# EasyEDA schematic 原理图_RecycleBin-4工控板V8.json
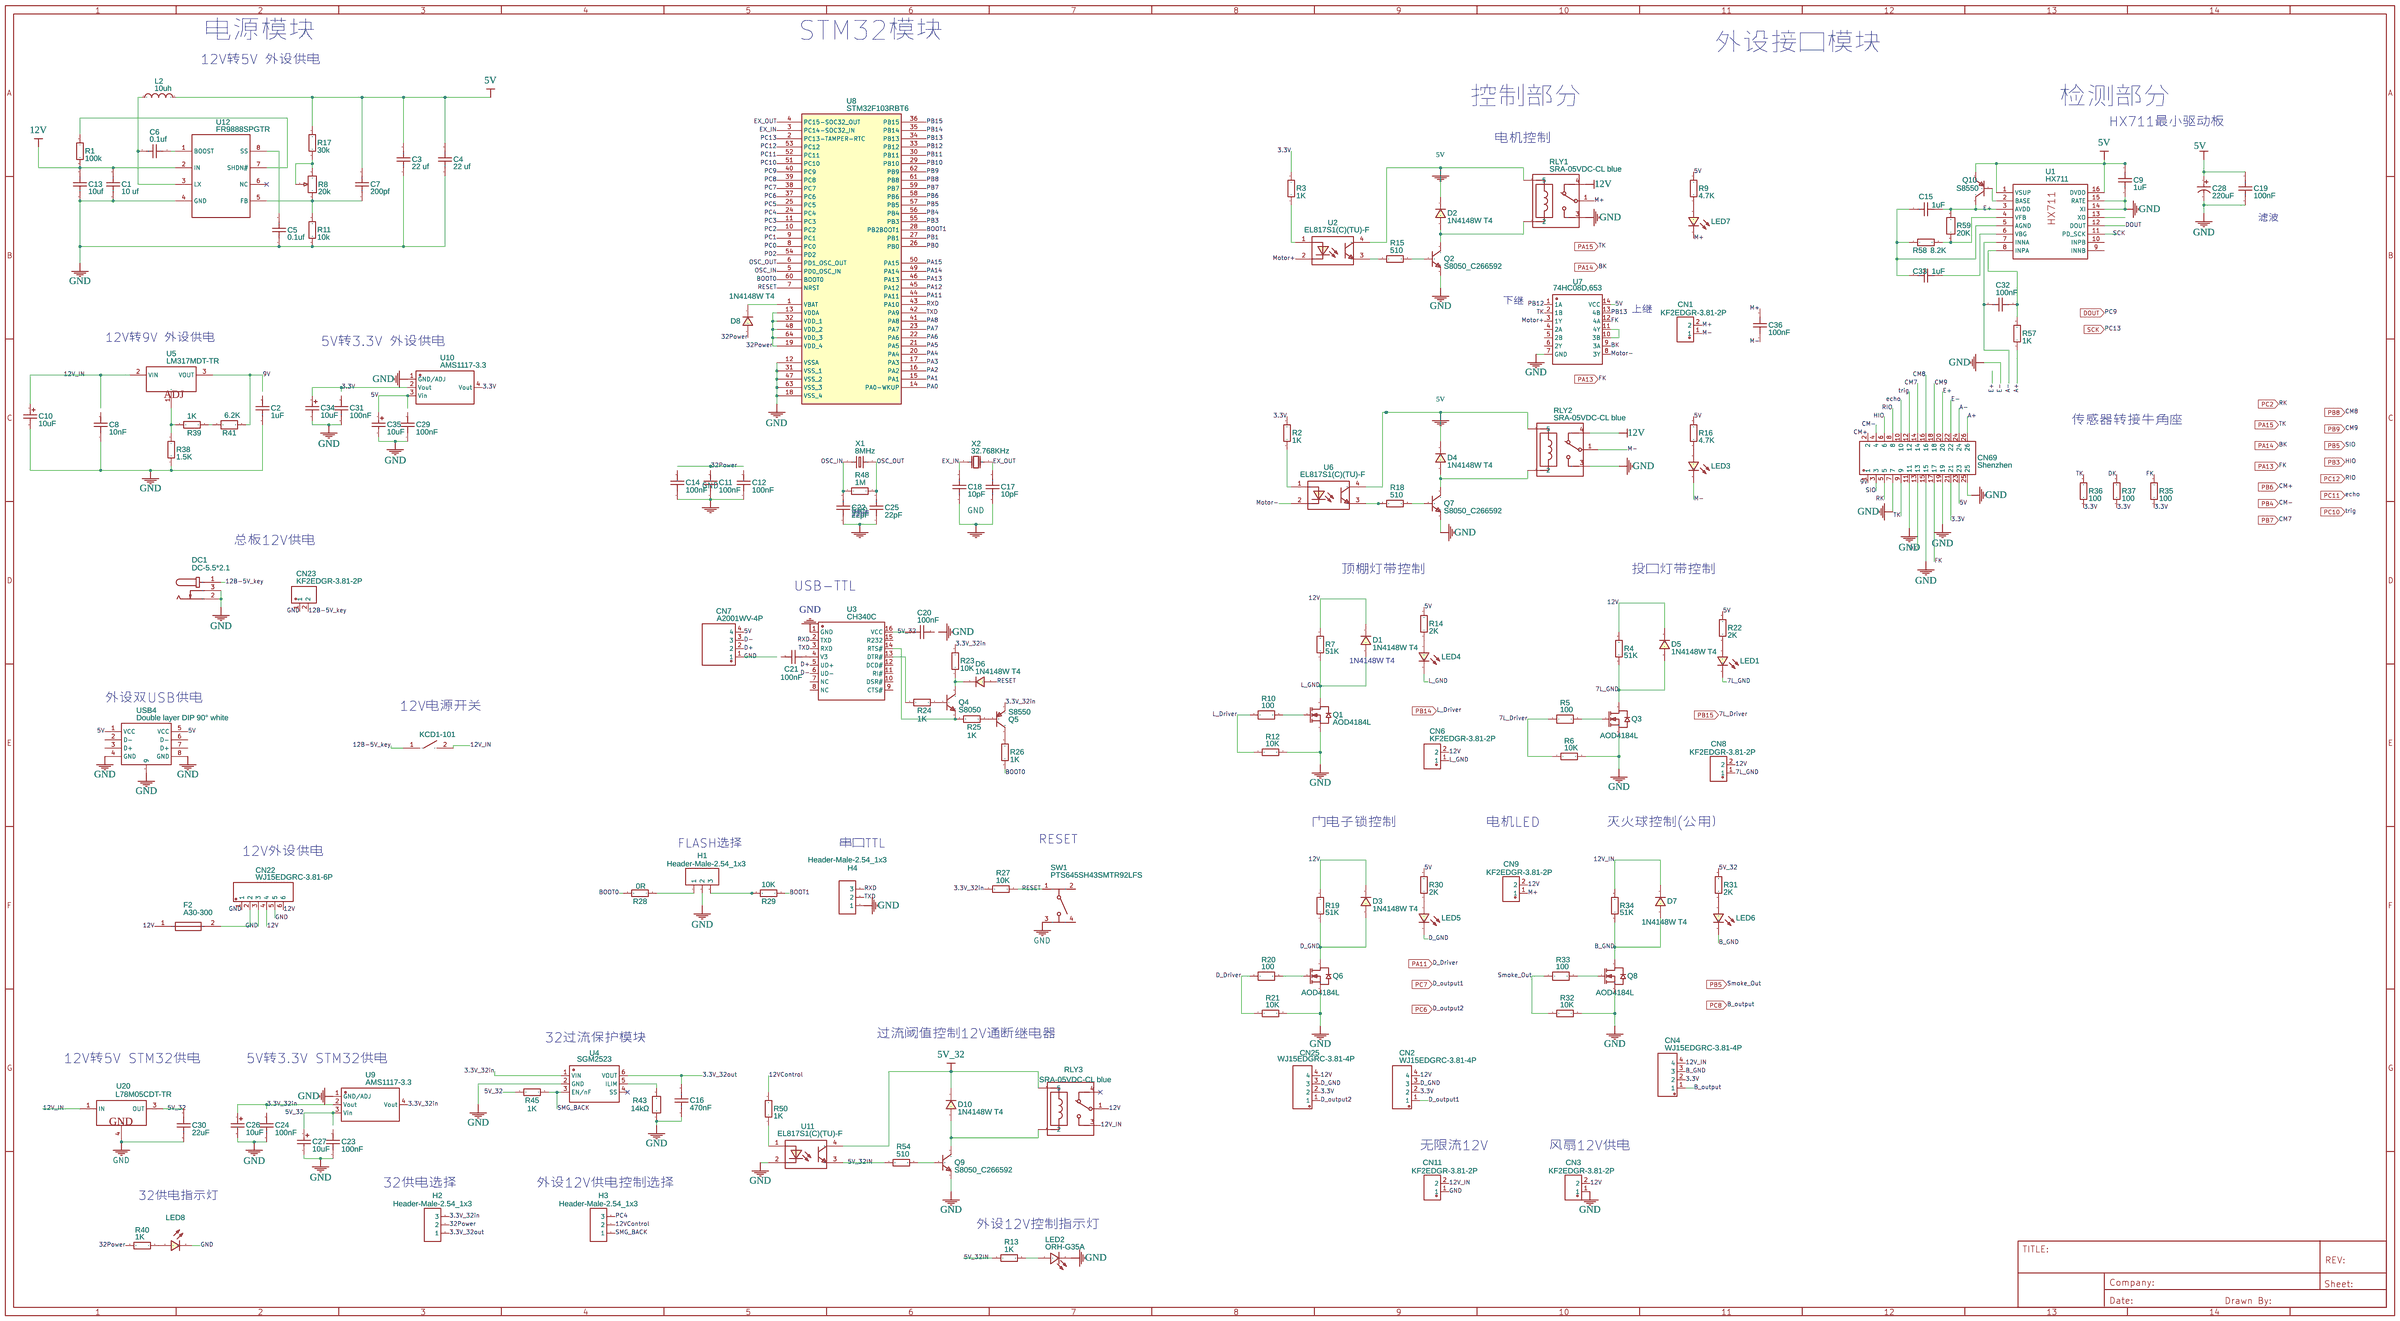
[diagram p0: schematic sheet]

## Parts
C1  10 uf  [C0603]
C2  1uF  [C0603]
C3  22 uf  [C0603]
C4  22 uf  [C0603]
C5  0.1uf  [C0603]
C6  0.1uf  [C0603]
C7  200pf  [C0603]
C8  10nF  [C0603]
C9  1uF  [C0603]
C10  10uF  [CAP-SMD_L3.2-W1.6-R-RD]
C11  100nF  [C0603]
C12  100nF  [C0603]
C13  10uf  [C0603]
C14  100nF  [C0603]
C15  1uF  [C0603]
C16  470nF  [C0603]
C17  10pF  [C0603]
C18  10pF  [C0603]
C19  100nF  [C0603]
C20  100nF  [C0603]
C21  100nF  [C0603]
C22  22pF  [0603]
C23  100nF  [C0603]
C24  100nF  [C0603]
C25  22pF  [0603]
C26  10uF  [CAP-SMD_L3.2-W1.6-R-RD]
C27  10uF  [CAP-SMD_L3.2-W1.6-R-RD]
C28  220uF  [CAP-TH_BD8.0-P3.50-D1.0-FD]
C29  100nF  [C0603]
C30  22uF  [C0603]
C31  100nF  [C0603]
C32  100nF  [C0603]
C33  1uF  [C0603]
C34  10uF  [CAP-SMD_L3.2-W1.6-R-RD]
C35  10uF  [CAP-SMD_L3.2-W1.6-R-RD]
C36  100nF  [CAP-TH_L13.0-W6.0-P10.00-D0.6]
CN1  KF2EDGR-3.81-2P  [CONN-TH_2P-P3.81_KF2EDGR-3.81-2P]
CN2  WJ15EDGRC-3.81-4P  [CONN-TH_WJ15EDGRC-3.81-4P]
CN3  KF2EDGR-3.81-2P  [CONN-TH_2P-P3.81_KF2EDGR-3.81-2P]
CN4  WJ15EDGRC-3.81-4P  [CONN-TH_WJ15EDGRC-3.81-4P]
CN6  KF2EDGR-3.81-2P  [CONN-TH_2P-P3.81_KF2EDGR-3.81-2P]
CN7  A2001WV-4P  [CONN-TH_A2001WV-4P]
CN8  KF2EDGR-3.81-2P  [CONN-TH_2P-P3.81_KF2EDGR-3.81-2P]
CN9  KF2EDGR-3.81-2P  [CONN-TH_2P-P3.81_KF2EDGR-3.81-2P]
CN11  KF2EDGR-3.81-2P  [CONN-TH_2P-P3.81_KF2EDGR-3.81-2P]
CN22  WJ15EDGRC-3.81-6P  [CONN-TH_WJ15EDGRC-3.81-6P]
CN23  KF2EDGR-3.81-2P  [CONN-TH_2P-P3.81_KF2EDGR-3.81-2P]
CN25  WJ15EDGRC-3.81-4P  [CONN-TH_WJ15EDGRC-3.81-4P]
CN69  Shenzhen  [CONN-TH_26P-P2.54_B-3000S26P-0110]
D1  1N4148W T4  [SOD-123_L2.8-W1.8-LS3.7-RD]
D2  1N4148W T4  [SOD-123_L2.8-W1.8-LS3.7-RD]
D3  1N4148W T4  [SOD-123_L2.8-W1.8-LS3.7-RD]
D4  1N4148W T4  [SOD-123_L2.8-W1.8-LS3.7-RD]
D5  1N4148W T4  [SOD-123_L2.8-W1.8-LS3.7-RD]
D6  1N4148W T4  [SOD-123_L2.8-W1.8-LS3.7-RD]
D7  1N4148W T4  [SOD-123_L2.8-W1.8-LS3.7-RD]
D8  1N4148W T4  [SOD-123_L2.8-W1.8-LS3.7-RD]
D10  1N4148W T4  [SOD-123_L2.8-W1.8-LS3.7-RD]
DC1  DC-5.5*2.1  [DC5.5*2.1MM]
F2  A30-300  [FUSE-TH_11.4-W3.0-P5.10-D0.8-S1.20]
H1  Header-Male-2.54_1x3  [HDR-TH_3P-P2.54-V]
H2  Header-Male-2.54_1x3  [HDR-TH_3P-P2.54-V]
H3  Header-Male-2.54_1x3  [HDR-TH_3P-P2.54-V]
H4  Header-Male-2.54_1x3  [HDR-TH_3P-P2.54-V]
L2  10uh  [IND-SMD_L7.0-W6.6_FXL0630]
LED1  17-21/GHC-XS1T2M/3T  [LED0805-R-RD]
LED2  ORH-G35A  [LED0805-R-RD]
LED3  17-21/GHC-XS1T2M/3T  [LED0805-R-RD]
LED4  17-21/GHC-XS1T2M/3T  [LED0805-R-RD]
LED5  17-21/GHC-XS1T2M/3T  [LED0805-R-RD]
LED6  17-21/GHC-XS1T2M/3T  [LED0805-R-RD]
LED7  17-21/GHC-XS1T2M/3T  [LED0805-R-RD]
LED8  17-21/GHC-XS1T2M/3T  [LED0805-R-RD]
Q1  AOD4184L  [TO-252-2_L6.6-W6.1-P4.57-LS9.9-TL-CW]
Q2  S8050_C266592  [SOT-23-3_L2.9-W1.3-P1.90-LS2.4-BR]
Q3  AOD4184L  [TO-252-2_L6.6-W6.1-P4.57-LS9.9-TL-CW]
Q4  S8050  [SOT-23-3_L2.9-W1.6-P1.90-LS2.8-BR]
Q5  S8550  [SOT-23-3_L2.9-W1.3-P1.90-LS2.4-BR]
Q6  AOD4184L  [TO-252-2_L6.6-W6.1-P4.57-LS9.9-TL-CW]
Q7  S8050_C266592  [SOT-23-3_L2.9-W1.3-P1.90-LS2.4-BR]
Q8  AOD4184L  [TO-252-2_L6.6-W6.1-P4.57-LS9.9-TL-CW]
Q9  S8050_C266592  [SOT-23-3_L2.9-W1.3-P1.90-LS2.4-BR]
Q10  S8550  [SOT-23-3_L2.9-W1.6-P1.90-LS2.8-BR]
R1  100k  [R0603]
R2  1K  [R0603]
R3  1K  [R0603]
R4  51K  [R0603]
R5  100  [R0603]
R6  10K  [R0603]
R7  51K  [R0603]
R8  20k  [RES-ADJ-TH_3P-L9.5-W4.9-P2.50-L_3296W]
R9  4.7K  [R0603]
R10  100  [R0603]
R11  10k  [R0603]
R12  10K  [R0603]
R13  1K  [R0603]
R14  2K  [R0603]
R15  510  [R0603]
R16  4.7K  [R0603]
R17  30k  [R0603]
R18  510  [R0603]
R19  51K  [R0603]
R20  100  [R0603]
R21  10K  [R0603]
R22  2K  [R0603]
R23  10K  [R0603]
R24  1K  [R0603]
R25  1K  [R0603]
R26  1K  [R0603]
R27  10K  [R0603]
R28  0R  [R0603]
R29  10K  [R0603]
R30  2K  [R0603]
R31  2K  [R0603]
R32  10K  [R0603]
R33  100  [R0603]
R34  51K  [R0603]
R35  100  [R0603]
R36  100  [R0603]
R37  100  [R0603]
R38  1.5K  [0603]
R39  1K  [0603]
R40  1K  [R0603]
R41  6.2K  [R0603]
R43  14kΩ  [R0603]
R45  1K  [R0603]
R48  1M  [R0603]
R50  1K  [R0603]
R54  510  [R0603]
R57  1K  [R0603]
R58  8.2K  [R0603]
R59  20K  [R0603]
RLY1  SRA-05VDC-CL blue  [RELAY-TH_SRA-9VDC-CL]
RLY2  SRA-05VDC-CL blue  [RELAY-TH_SRA-9VDC-CL]
RLY3  SRA-05VDC-CL blue  [RELAY-TH_SRA-9VDC-CL]
S1??#1  KCD1-101
SW1  PTS645SH43SMTR92LFS  [KEY-SMD_4P-L6.0-W6.0-P4.50-LS9.0]
U1  HX711  [SOP-16_L10.0-W3.9-P1.27-LS6.0-BL]
U2  EL817S1(C)(TU)-F  [OPTO-SMD-4_L4.6-W6.5-P2.54-LS10.3-TL]
U3  CH340C  [SOP-16_150MIL]
U4  SGM2523  [SOT-23-6_L2.9-W1.6-P0.95-LS2.8-BR]
U5  LM317MDT-TR  [TO-252-2_L6.6-W6.1-P4.57-LS9.9-TL]
U6  EL817S1(C)(TU)-F  [OPTO-SMD-4_L4.6-W6.5-P2.54-LS10.3-TL]
U7  74HC08D,653  [SOIC-14_L8.7-W3.9-P1.27-LS6.0-BL]
U8  STM32F103RBT6  [LQFP-64_L10.0-W10.0-P0.50-LS12.0-BL]
U9  AMS1117-3.3  [SOT-223-3_L6.5-W3.4-P2.30-LS7.0-BR]
U10  AMS1117-3.3  [SOT-223-3_L6.5-W3.4-P2.30-LS7.0-BR]
U11  EL817S1(C)(TU)-F  [OPTO-SMD-4_L4.6-W6.5-P2.54-LS10.3-TL]
U12  FR9888SPGTR  [SOIC-8_L5.0-W4.0-P1.27-LS6.0-BL-EP]
U20  L78M05CDT-TR  [TO-252-2_L6.5-W6.1-P4.58-LS10.0-TL]
USB4  Double layer DIP 90° white  [USB-A-TH_USB-M-51]
X1  8MHz  [HC-49US_L11.5-W4.5-P4.88]
X2  32.768KHz  [OSC-TH_BD2.0-P0.70-D0.3]

## Library data of the parts
C1 C3-C7 C13 = 0603B104K500CT_C314282: Supplier: LCSC; Supplier Part: C314282; Manufacturer: Walsin Tech Corp; Manufacturer Part: 0603B104K500CT; Contributor: LCSC
C2 C8 C11 C12 C14 C20 C21 C23 C24 C29 C31 = Capacitor: Manufacturer Part: ?
C9 C15 C33 = GRM185R61E105KA12D: Supplier: LCSC; Supplier Part: C162200; Manufacturer: Murata Electronics; Contributor: LCSC
C10 C26 C27 C34 C35 = CA45-A010K106T: Supplier: LCSC; Manufacturer: Xiangyee; Supplier Part: C119052; LCSC Assembly: Yes; SMT Type: Extend
C16 = CGA3E3X7R1E474KT0Y0N: Supplier: LCSC; Supplier Part: C342987; Manufacturer: TDK; Contributor: LCSC
C17 C18 = 0603CG100J500NT: Supplier: LCSC; Manufacturer: FH; Supplier Part: C91367
C19 C32 = HMK107B7104KAHT: Supplier: LCSC; Supplier Part: C268011; Manufacturer: Taiyo Yuden; Contributor: LCSC
C22 C25 = 0603CG220F500NT: Supplier: LCSC; Supplier Part: C190086; Manufacturer: Guangdong Fenghua Advanced Tech; Contributor: LCSC
C28 = KF221M035F115A: Supplier: LCSC; Manufacturer: CapXon; Supplier Part: C59335
C30 = GRM188R61A226ME15D: Supplier: LCSC; Manufacturer: MuRata; Supplier Part: C84419
C36 = SMXDX104KC3XXAB1015: Supplier: LCSC; Supplier Part: C155784; Manufacturer: DAIN Elec; Contributor: LCSC; Paste Type: expand; Assembly Type: manualWeld
CN1 CN3 CN6 CN8 CN9 CN11 CN23 = KF2EDGR-3.81-2P: Supplier: LCSC; Supplier Part: C441182; Manufacturer: Cixi Kefa Elec; Contributor: LCSC
CN2 CN4 CN25 = WJ15EDGRC-3.81-4P: Supplier: LCSC; Manufacturer: ReliaPro; image: //image.lceda.cn/szlcsc/C7245.jpg; Supplier Part: C7245; Paste Type: expand; Assembly Type: manualWeld
CN7 = A2001WV-4P: Supplier: LCSC; Supplier Part: C225190; Manufacturer: Changjiang Connectors; Contributor: LCSC
CN22 = WJ15EDGRC-3.81-6P: Supplier: LCSC; Manufacturer: ReliaPro; image: //image.lceda.cn/szlcsc/C7246.jpg; Supplier Part: C7246
CN69 = B-3000S26P-0110: Supplier: LCSC; Supplier Part: C383600; Manufacturer: Shenzhen Cankemeng; Contributor: LCSC
D1-D8 D10 = 1N4148W T4: Supplier: LCSC; Manufacturer: CJ; image: //image.lceda.cn/szlcsc/C2099.jpg; Supplier Part: C2099; Contributor: 立创EDA官方封装库; LCSC Assembly: Yes; SMT Type: Extend
DC1 = DC-5.5*2.1: Contributor: IoT-J
F2 = A30-300: Supplier: LCSC; Manufacturer: JDTFUSE; Contributor: LCSC; Supplier Part: C135414
H1-H4 = Header-Male-2.54_1x3: Supplier: LCSC; Manufacturer: BOOMELE; Manufacturer Part: Header2.54mm 1*3P; image: //image.lceda.cn/szlcsc/C49257.jpg; Supplier Part: C49257; Paste Type: expand; Assembly Type: manualWeld
L2 = FXL0630-100-M: Supplier: LCSC; Manufacturer: cjiang; Contributor: LCSC; Supplier Part: C167223
LED1 LED3-LED8 = 17-21/GHC-XS1T2M/3T: Supplier: LCSC; Manufacturer: EVERLIGHT; image: //image.lceda.cn/szlcsc/C63855.jpg; Supplier Part: C63855; LCSC Assembly: Yes; SMT Type: Extend
LED2 = ORH-G35A: Supplier: LCSC; Supplier Part: C205442; Manufacturer: Orient; Contributor: LCSC; SMT Type: Extend; JLCPCB SMD: Yes
Q1 Q3 Q6 Q8 = AOD4184L: Supplier: LCSC; Supplier Part: C125866; Manufacturer: Alpha & Omega Semicon; Contributor: LCSC; LCSC Assembly: Yes; SMT Type: Extend
Q2 Q7 Q9 = S8050_C266592: Supplier: LCSC; Supplier Part: C266592; Manufacturer: Bourne Semicon (Shenzhen); Manufacturer Part: S8050; Contributor: LCSC; LCSC Assembly: Yes; SMT Type: Extend
Q4 = S8050_C181158: Supplier: LCSC; Manufacturer: Hottech; Contributor: LCSC; Supplier Part: C181158; LCSC Assembly: Yes; SMT Type: Extend
Q5 = S8550_C545533: Supplier: LCSC; Supplier Part: C545533; Manufacturer: UMW(Youtai Semiconductor Co., Ltd.); Contributor: LCSC
Q10 = S8550_C181159: Supplier: LCSC; Manufacturer: Hottech; Contributor: LCSC; Supplier Part: C181159; LCSC Assembly: Yes; SMT Type: Extend
R1 R11 R17 R48 = RMC06031M1%N: Supplier: LCSC; Supplier Part: C269705; Manufacturer: Tyohm; Contributor: LCSC
R2 R3 R15 R18 R54 = ARG03FTC5100: Supplier: LCSC; Supplier Part: C218061; Manufacturer: Viking Tech; Contributor: LCSC
R4 R7 R19 R24-R26 R34 = RT0603FRE071KL: Supplier: LCSC; Supplier Part: C375503; Manufacturer: YAGEO; Contributor: LCSC
R5 R10 R20 R33 R41 = WR06X510 JTL: Supplier: LCSC; Supplier Part: C384214; Manufacturer: Walsin Tech Corp; Contributor: LCSC
R6 R12 R21 R27 R32 R45 R50 = RMCF0603JT10K0: Supplier: LCSC; Supplier Part: C238881; Manufacturer: Stackpole Elec; Contributor: LCSC
R8 = 3296W-1-500: Supplier: LCSC; Supplier Part: C118908; Manufacturer: Chengdu Guosheng Tech; Resistance(Ohms): 50; Contributor: LCSC
R9 R14 R16 R22 R30 R31 R35-R37 R40 = 0603WAF1501T5E: Supplier: LCSC; Manufacturer: UniOhm; LCSC Assembly: Yes; Supplier Part: C22843; SMT Type: Basic
R13 = 0603WAF3601T5E: Supplier: LCSC; Manufacturer: UniOhm; LCSC Assembly: Yes; Supplier Part: C22980; SMT Type: Basic
R23 R28 R29 = RMC060310K1%N: Supplier: LCSC; Supplier Part: C269701; Manufacturer: Tyohm; Contributor: LCSC
R38 R39 = RTT03681JTP: Supplier: LCSC; Manufacturer: RALEC; Supplier Part: C103784
R43 = RT0603BRD0714KL: Supplier: LCSC; Supplier Part: C723488; Manufacturer: YAGEO; Contributor: LCSC
R57 = SY0603JN1KP: Supplier: LCSC; Supplier Part: C380759; Manufacturer: SANYEAR; Contributor: LCSC
R58 = RMC06038.2K5%N: Supplier: LCSC; Supplier Part: C325749; Manufacturer: Tyohm; Contributor: LCSC
R59 = AC0603DR-0720KL: Supplier: LCSC; Supplier Part: C227463; Manufacturer: YAGEO; Contributor: LCSC
RLY1-RLY3 = SRA-05VDC-CL blue: Supplier: LCSC; Manufacturer: SONGLE; Supplier Part: C87714
S1??#1 = KCD1-101
SW1 = PTS645SH43SMTR92LFS: Supplier: LCSC; Supplier Part: C285463; Manufacturer: C&K; Contributor: LCSC
U1 = HX711: Supplier: LCSC; Manufacturer: AVIA; image: //image.lceda.cn/szlcsc/C43656.jpg; Supplier Part: C43656
U2 U6 U11 = EL817S1(C)(TU)-F: Supplier: LCSC; Manufacturer: EVERLIGHT; Supplier Part: C106900; LCSC Assembly: Yes; SMT Type: Basic
U3 = -: Supplier: LCSC; Manufacturer: WCH; Supplier Part: C84681
U4 = SN74LVC2G14DBVR: Supplier: LCSC; Manufacturer: TI; image: //image.lceda.cn/szlcsc/C12401.jpg; Supplier Part: C12401; Paste Type: recommend; Assembly Type: smtWeld
U5 = LM317MDT-TR: Supplier: LCSC; Manufacturer: STMicroelectronics; Supplier Part: C68136; LCSC Assembly: Yes; SMT Type: Extend
U7 = 74HC08D,653: Supplier: LCSC; Manufacturer: Nexperia; LCSC Assembly: Yes; image: //image.lceda.cn/szlcsc/C5593.jpg; Supplier Part: C5593; SMT Type: Basic
U8 = STM32F103RBT6: Supplier: LCSC; Manufacturer: STMicroelectronics; LCSC Assembly: Yes; image: //image.lceda.cn/szlcsc/C8735.jpg; Supplier Part: C8735; SMT Type: Basic
U9 U10 = AMS1117-3.3: sourceId: dwIGgezVh; Supplier: LCSC; Manufacturer: AMS; LCSC Assembly: Yes; image: //image.lceda.cn/szlcsc/C6186.jpg; Supplier Part: C6186; SMT Type: Basic
U12 = FR9888SPGTR: Supplier: LCSC; Manufacturer: FITIPOWER; image: //image.lceda.cn/szlcsc/C80507.jpg; Supplier Part: C80507; SMT Type: Extend; JLCPCB SMD: Yes
U20 = L78M05CDT-TR: Supplier: LCSC; Manufacturer: STMicroelectronics; image: //image.lceda.cn/szlcsc/C55509.jpg; Supplier Part: C55509; LCSC Assembly: Yes; SMT Type: Extend
USB4 = Double layer DIP 90° white: Supplier: LCSC; Manufacturer: ValuePro; Supplier Part: C2341
X1 = 49S-8.000-20-20-20/A: Supplier: LCSC; Supplier Part: C240916; Manufacturer: Suzhou Liming Elec; Contributor: LCSC
X2 = DT-26 32.768KHz: Supplier: LCSC; Manufacturer: KDS; Supplier Part: C93229

## Nets
3.3V: C34.1 CN2.2 CN4.2 CN25.2 CN69.21 R2.2 R3.2 R35.1 R36.1 R37.1 U10.2(Vout) U10.4(Vout)
3.3V_32in: C26.1 H2.3 Q5.2(E) R23.2 R27.1 U4.1(VIN) U9.2(Vout) U9.4(Vout)
3.3V_32out: C16.2 H2.1 U4.6(VOUT)
5V: C3.2 C4.2 C7.2 C9.1 C19.1 C28.1 C35.1 CN7.4 CN69.23 D2.1(K) D4.1(K) L2.2 Q10.2(E) R9.2 R14.2 R16.2 R17.1 R22.2 R30.2 RLY1.5 RLY2.5 U1.1(VSUP) U1.16(DVDD) U2.4(COL) U6.4(COL) U7.14(VCC) U10.3(Vin) USB4.1(VCC) USB4.5(VCC)
5V_32: C20.1 C27.1 C30.2 D10.1(K) R31.2 R45.1 RLY3.5 U3.16(VCC) U9.3(Vin) U11.4(COL) U20.3(OUT)
5V_32IN: R13.1 R54.1 U11.3(EM)
9V: CN69.1 R41.2 U5.3(VOUT)
12V: C1.2 C13.2 CN2.4 CN3.2 CN6.2 CN8.2 CN9.2 CN22.4 CN22.6 CN25.4 D1.1(K) D3.1(K) D5.1(K) F2.1 R1.2 R4.2 R7.2 R19.2 RLY1.4 RLY2.4 RLY3.1 U12.2(IN)
12V_IN: C10.1 CN4.4 CN11.2 D7.1(K) R34.2 RLY3.3 S1??#1.2 U5.2(VIN) U20.1(IN)
12VControl: H3.2 R50.2
GND: C1.1 C2.1 C3.1 C4.1 C5.1 C8.1 C9.2 C10.2 C11.1 C12.1 C13.1 C14.1 C16.1 C17.1 C18.1 C19.2 C22.1 C23.1 C24.1 C25.1 C26.2 C27.2 C28.2 C29.1 C30.1 C31.1 C34.2 C35.2 CN3.1 CN7.1 CN11.1 CN22.1 CN22.3 CN22.5 CN23.1 CN69.7 CN69.11 CN69.15 CN69.19 CN69.22 CN69.25 DC1.2 DC1.3 H1.2 H4.1 LED2.2(C) LED8.2(C) Q1.3(S) Q2.2(E) Q3.3(S) Q6.3(S) Q7.2(E) Q8.3(S) Q9.2(E) R6.2 R11.2 R12.2 R21.2 R32.2 R38.1 R43.1 RLY1.3 RLY2.3 SW1.3 U1.14(XI) U1.15(RATE) U3.1(GND) U4.2(GND) U7.7(GND) U8.12(VSSA) U8.18(VSS_4) U8.31(VSS_1) U8.47(VSS_2) U8.63(VSS_3) U9.1(GND/ADJ) U10.1(GND/ADJ) U11.2(CAT) U12.4(GND) U20.4(GND) USB4.4(GND) USB4.8(GND) USB4.9
7L_GND: CN8.1 D5.2(A) LED1.2(C) Q3.2(D) R4.1
12B-5V_key: CN23.2 DC1.1 S1??#1.1
32Power: D8.2(A) H2.2 R40.2 U8.13(VDDA) U8.19(VDD_4) U8.32(VDD_1) U8.48(VDD_2) U8.64(VDD_3)
A+: CN69.26 R57.1
A-: C32.2 CN69.24 U1.7(INNA)
B_GND: CN4.3 D7.2(A) LED6.2(C) Q8.2(D) R34.1
BOOT0: R26.1 R28.2 U8.60(BOOT0)
BOOT1: R29.1 U8.28(PB2BOOT1)
D+: CN7.2 U3.5(UD+)
D-: CN7.3 U3.6(UD-)
D_GND: CN2.3 CN25.3 D3.2(A) LED5.2(C) Q6.2(D) R19.1
DK: CN69.13 R37.2
DOUT: U1.12(DOUT) U8.40(PC9)
E+: C15.1 CN69.20 Q10.3(C) R59.2 U1.3(AVDD)
EX_IN: C18.2 U8.3(PC14-SOC32_IN) X2.2(OSC2)
EX_OUT: C17.2 U8.4(PC15-SOC32_OUT) X2.1(OSC1)
L_GND: CN6.1 D1.2(A) LED4.2(C) Q1.2(D) R7.1
M+: C36.2 CN1.2 CN9.1 LED7.2(C) RLY1.1
M-: C36.1 CN1.1 LED3.2(C) RLY2.1
Motor+: U2.2(CAT) U7.3(1Y)
Motor-: U6.2(CAT) U7.8(3Y)
OSC_IN: C22.2 R48.1 U8.5(PD0_OSC_IN) X1.1
OSC_OUT: C25.2 R48.2 U8.6(PD1_OSC_OUT) X1.2
PA0: U8.14(PA0-WKUP)
PA1: U8.15(PA1)
PA2: U8.16(PA2)
PA3: U8.17(PA3)
PA4: U8.20(PA4)
PA5: U8.21(PA5)
PA6: U8.22(PA6)
PA7: U8.23(PA7)
PA8: U8.41(PA8)
PA11: R20.1 R21.1 U8.44(PA11)
PA12: U8.45(PA12)
PA13: CN69.17 R35.2 U7.12(4A) U8.46(PA13)
PA14: U7.9(3A) U8.49(PA14)
PA15: CN69.9 R36.2 U7.2(1B) U8.50(PA15)
PB0: U8.26(PB0)
PB1: U8.27(PB1)
PB3: CN69.6 U8.55(PB3)
PB4: CN69.4 U8.56(PB4)
PB5: CN69.3 R32.1 R33.1 U8.57(PB5)
PB6: CN69.2 U8.58(PB6)
PB7: CN69.14 U8.59(PB7)
PB8: CN69.16 U8.61(PB8)
PB9: CN69.18 U8.62(PB9)
PB10: U8.29(PB10)
PB11: U8.30(PB11)
PB12: U7.1(1A) U8.33(PB12)
PB13: U7.13(4B) U8.34(PB13)
PB14: R10.1 R12.1 U8.35(PB14)
PB15: R5.1 R6.1 U8.36(PB15)
PC0: U8.8(PC0)
PC1: U8.9(PC1)
PC2: CN69.5 U8.10(PC2)
PC3: U8.11(PC3)
PC4: H3.3 U8.24(PC4)
PC5: U8.25(PC5)
PC6: CN25.1 U8.37(PC6)
PC7: CN2.1 U8.38(PC7)
PC8: CN4.1 U8.39(PC8)
PC10: CN69.12 U8.51(PC10)
PC11: CN69.10 U8.52(PC11)
PC12: CN69.8 U8.53(PC12)
PD2: U8.54(PD2)
RESET: D6.2(A) R27.2 SW1.1 U8.7(NRST)
RXD: H4.3 U3.2(TXD) U8.43(PA10)
SCK: U1.11(PD_SCK) U8.2(PC13-TAMPER-RTC)
SMG_BACK: H3.1 R45.2 U4.3(EN/nF)
TXD: H4.2 U3.3(RXD) U8.42(PA9)
Net-(CN22-Pad2): CN22.2 F2.2
Net-(D2-A): D2.2(A) Q2.3(C) RLY1.2
Net-(D4-A): D4.2(A) Q7.3(C) RLY2.2
Net-(D6-K): D6.1(K) Q4.3 R23.1
Net-(D8-K): D8.1(K) U8.1(VBAT)
Net-(D10-A): D10.2(A) Q9.3(C) RLY3.2
Net-(H1-Pad1): H1.1 R28.1
Net-(H1-Pad3): H1.3 R29.2
Net-(LED1-A): LED1.1(A) R22.1
Net-(LED2-A): LED2.1(A) R13.2
Net-(LED3-A): LED3.1(A) R16.1
Net-(LED4-A): LED4.1(A) R14.1
Net-(LED5-A): LED5.1(A) R30.1
Net-(LED6-A): LED6.1(A) R31.1
Net-(LED7-A): LED7.1(A) R9.1
Net-(LED8-A): LED8.1(A) R40.1
Net-(Q1-G): Q1.1(G) R10.2
Net-(Q2-B): Q2.1(B) R15.2
Net-(Q3-G): Q3.1(G) R5.2
Net-(Q4-Pad1): Q4.1 R24.2
Net-(Q5-B): Q5.1(B) R25.2
Net-(Q5-C): Q5.3(C) R26.2
Net-(Q6-G): Q6.1(G) R20.2
Net-(Q7-B): Q7.1(B) R18.2
Net-(Q8-G): Q8.1(G) R33.2
Net-(Q9-B): Q9.1(B) R54.2
Net-(Q10-B): Q10.1(B) U1.2(BASE)
Net-(R17-Pad2): R8.2 R8.3 R17.2
Net-(R39-Pad2): R39.2 R41.1
Net-(U1-AGND): C15.2 C33.2 R58.1 U1.5(AGND)
Net-(U1-INPA): C32.1 R57.2 U1.8(INPA)
Net-(U1-VBG): C33.1 U1.6(VBG)
Net-(U1-VFB): R58.2 R59.1 U1.4(VFB)
Net-(U2-AN): R3.1 U2.1(AN)
Net-(U2-EM): R15.1 U2.3(EM)
Net-(U3-DTR#): R24.1 U3.13(DTR#)
Net-(U3-RTS#): Q4.2 R25.1 U3.14(RTS#)
Net-(U3-V3): C21.1 U3.4(V3)
Net-(U4-ILIM): R43.2 U4.5(ILIM)
Net-(U5-ADJ): R38.2 R39.1 U5.1(ADJ)
Net-(U6-AN): R2.1 U6.1(AN)
Net-(U6-EM): R18.1 U6.3(EM)
Net-(U7-3B): U7.10(3B) U7.11(4Y)
Net-(U11-AN): R50.1 U11.1(AN)
Net-(U12-BOOST): C6.1 U12.1(BOOST)
Net-(U12-FB): C7.1 R8.1 R11.1 U12.5(FB)
Net-(U12-LX): C6.2 L2.1 U12.3(LX)
Net-(U12-SHDN#): R1.1 U12.7(SHDN#)
Net-(U12-SS): C5.2 U12.8(SS)

Not connected (* = marked no-connect by the designer): C2 2; C8 2; C11 2; C12 2; C14 2; C20 2; C21 2; C23 2; C24 2; C29 2; C31 2; RLY3 4; SW1 2 4; U1 9(INNB) 10(INPB) 13(XO); U3 7(NC) 8(NC) 9(CTS#) 10(DSR#) 11(RI#) 12(DCD#) 15(R232); U4 4(SS)*; U7 4(2A) 5(2B) 6(2Y); U12 6(NC)*; USB4 2(D-) 3(D+) 6(D-) 7(D+)

## Notes on the sheet
- 电源模块
- STM32模块
- 外设接口模块
- 12V转5V 外设供电
- 控制部分
- 检测部分
- HX711最小驱动板
- 电机控制
- 滤波
- 下继
- 上继
- 12V转9V 外设供电
- 5V转3.3V 外设供电
- 传感器转接牛角座
- 22pF
- 总板12V供电
- 顶棚灯带控制
- 投口灯带控制
- USB-TTL
- 1N4148W T4
- 外设双USB供电
- 12V电源开关
- 门电子锁控制
- 电机LED
- 灭火球控制(公用）
- FLASH选择
- 串口TTL
- RESET
- 12V外设供电
- 过流阈值控制12V通断继电器
- 32过流保护模块
- 12V转5V STM32供电
- 5V转3.3V STM32供电
- 无限流12V
- 风扇12V供电
- 32供电选择
- 外设12V供电控制选择
- 32供电指示灯
- 外设12V控制指示灯
